# Altium schematic sheet 05-Power.SchDoc
size A
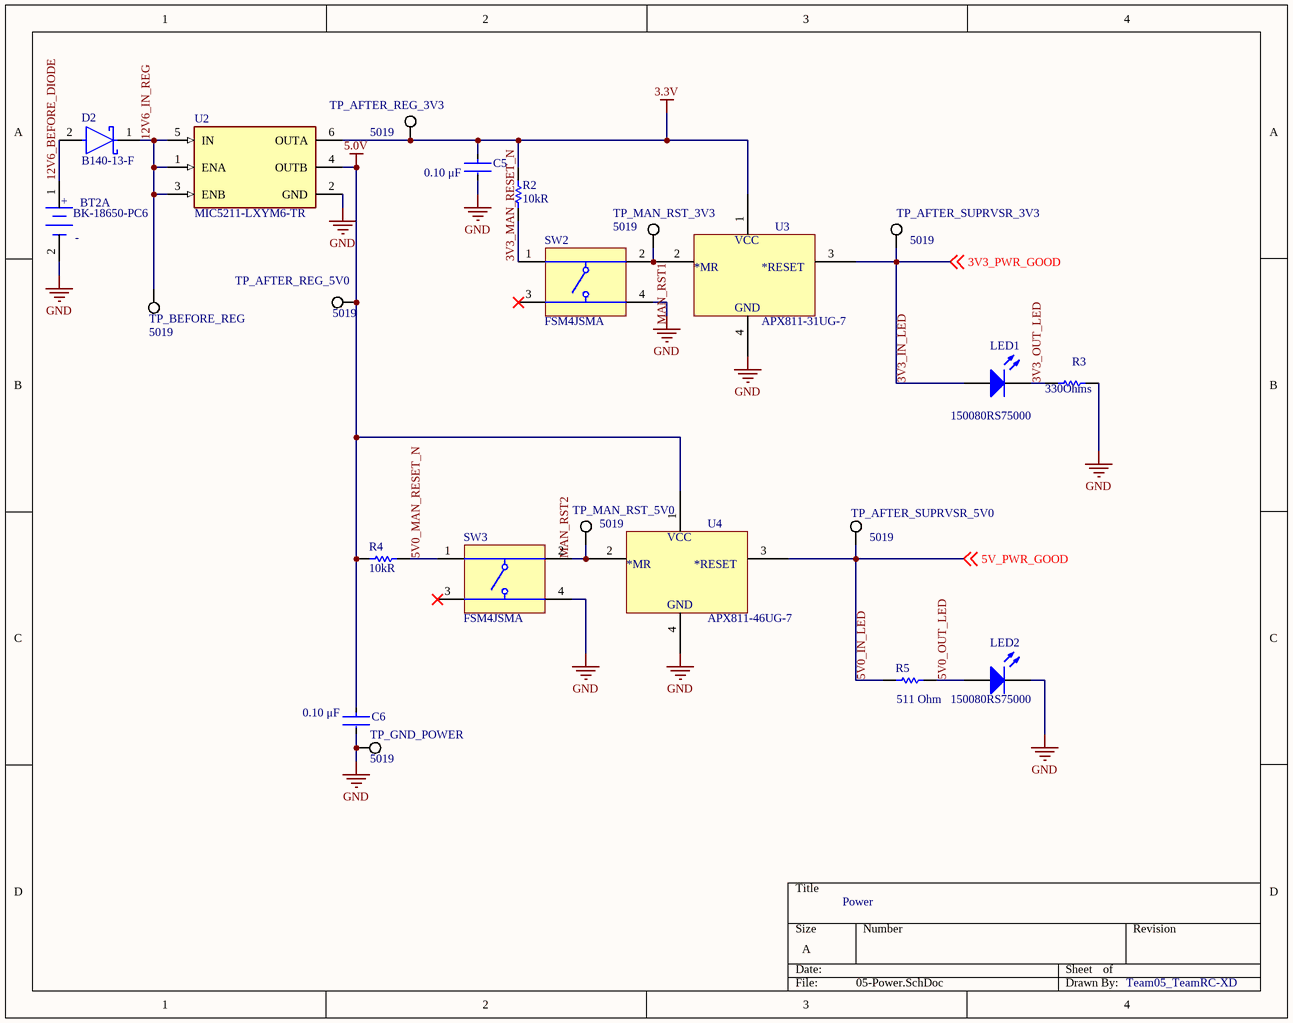
[diagram p0: 05-Power.SchDoc]

## Parts
BT2  BK-18650-PC6  [FP-BK-18650-PC6-MFG]  (part A of 3)
C5  Capacitance: 0.10 μF  [FP-C0805C-DN-MFG]  (hidden comment: C0805C104K1RACAUTO)
C6  Capacitance: 0.10 μF  [FP-C0805C-DN-MFG]  (hidden comment: C0805C104K1RACAUTO)
D2  B140-13-F  [FP-SMA-MFG]
LED1  150080RS75000  [0805_A]
LED2  150080RS75000  [0805_A]
R2  Resistance: 10kR  [RESC2013X60X35NL10T20]  (hidden comment: RC0805FR-0710KL)
R3  Resistance: 330Ohms  [RESC2013X60X35LL10T20]  (hidden comment: RC0805FR-07330RL)
R4  Resistance: 10kR  [RESC2013X60X35NL10T20]  (hidden comment: RC0805FR-0710KL)
R5  Resistance: 511 Ohm  [RESC2013X70X40ML20T20]  (hidden comment: ERJ-6ENF5110V)
SW2  FSM4JSMA  [TECO-FSM4JSMA_V]
SW3  FSM4JSMA  [TECO-FSM4JSMA_V]
TP_AFTER_REG_3V3  5019  [KSTN-5019_V]
TP_AFTER_REG_5V0  5019  [KSTN-5019_V]
TP_AFTER_SUPRVSR_3V3  5019  [KSTN-5019_V]
TP_AFTER_SUPRVSR_5V0  5019  [KSTN-5019_V]
TP_BEFORE_REG  5019  [KSTN-5019_V]
TP_GND_POWER  5019  [KSTN-5019_V]
TP_MAN_RST_3V3  5019  [KSTN-5019_V]
TP_MAN_RST_5V0  5019  [KSTN-5019_V]
U2  MIC5211-LXYM6-TR  [FP-SOT23-6LD-PL-1-MFG]
U3  APX811-31UG-7  [SOT143]
U4  APX811-46UG-7  [SOT143]

## Nets
3.3V: C5.1 R2.2 TP_AFTER_REG_3V3.1 U2.6(OUTA) U3.1
5.0V: C6.1 R4.2 TP_AFTER_REG_5V0.1 U2.4(OUTB) U4.1
GND: BT2.2(1_-) C5.2 C6.2 LED2.1(K) R3.2 SW2.4 SW3.4 TP_GND_POWER.1 U2.2(GND) U3.4 U4.4
3V3_IN_LED: LED1.2(A) TP_AFTER_SUPRVSR_3V3.1 U3.3 ; off-sheet 3V3_PWR_GOOD  [also labelled 3V3_PWR_GOOD]
3V3_MAN_RESET_N: R2.1 SW2.1
3V3_OUT_LED: LED1.1(K) R3.1
5V0_IN_LED: R5.1 TP_AFTER_SUPRVSR_5V0.1 U4.3 ; off-sheet 5V_PWR_GOOD  [also labelled 5V_PWR_GOOD]
5V0_MAN_RESET_N: R4.1 SW3.1
5V0_OUT_LED: LED2.2(A) R5.2
12V6_BEFORE_DIODE: BT2.1(1_+) D2.2(A)
12V6_IN_REG: D2.1(C) TP_BEFORE_REG.1 U2.1(ENA) U2.3(ENB) U2.5(IN)
MAN_RST1: SW2.2 TP_MAN_RST_3V3.1 U3.2
MAN_RST2: SW3.2 TP_MAN_RST_5V0.1 U4.2

Not connected (* = marked no-connect by the designer): SW2 3*; SW3 3*

## Notes on the sheet
- Power
- Team05_TeamRC-XD
- (in symbol APX811-31UG-7) VCC; *MR; *RESET; GND
- (in symbol APX811-46UG-7) VCC; *MR; *RESET; GND
- (in symbol CMP-136234-000001-1, part A) +

## Library data of the parts
BT2 = CMP-136234-000001-1: BATT HOLDER 18650 3 CELL PC PIN; Manufacturer: MPD (Memory Protection Devices); Pitch: 72.9mm; Number Of Contacts: 3; Conn Orientation: Top View; Conn Gender: Female; Octopart: https://octopart.com/bk-18650-pc6-memory+protection+devices-19049091; ComponentLink2URL: http://www.memoryprotectiondevices.com/datasheets/BK-18650-PC6-datasheet.pdf; Category: Batt; RoHS: TRUE; Temperature Range High: +180°C; Height: 22.04mm; Device Class L2: Power Connectors; Digikey Description: BATT HOLDER 18650 3 CELL PC PIN; ComponentLink2Description: Datasheet; Temperature: -40°C to +180°C; Device Class L1: Connectors; Lead Free: Yes; Device Class L3: unset; Contact Material: Nickel; Automotive: No; Temperature Range Low: -40°C; Manufacturer Part Number: BK-18650-PC6; Package: 0; Supplier 1: Digi-Key; Supplier Part Number 1: BK-18650-PC6-ND; Stock 1: 1587; Pricing 1: 1=7.26000, 10=6.10600, 50=5.36040, 100=5.04800, 250=4.63932, 500=4.35088, 1000=4.06242, 2500=3.67782 (USD); Mount: Through Hole,PCB; Package Quantity: 100; Number of Cells: 3; Termination: PC Pin; Series: -; ComponentLink1URL: https://datasheet.ciiva.com/3/bk-18650-pc6-datasheet-3897.pdf?src-supplier=Digi-Key; ComponentLink1Description: https://datasheet.ciiva.com/3/bk-18650-pc6-datasheet-3897.pdf?src-supplier=Digi-Key
C5 C6 = CMP-2007-03648-2: CAP CER 0.1UF 100V X7R 0805; Manufacturer: KEMET; Temperature Coefficient: 30ppm/°C; Material: Ceramic; Tolerance: 0.1; Value: 0.10 μF; Category: Cap; Temperature: -55°C to +125°C; ComponentLink2Description: Datasheet; Temperature Range Low: -55°C; Device Class L2: Capacitors; ComponentLink2URL: https://content.kemet.com/datasheets/KEM_C1003_C0G_SMD.pdf; Ipc Land Pattern Name: CAPC200125X78; Temperature Range High: +125°C; Package: C0805C-DN; Temperature Characteristic: X7R; Height: 0.88mm; Digikey Description: CAP CER 0.1UF 100V X7R 0805; Voltage Rating: 100 V; Device Class L3: Ceramic Capacitors; Manufacturer Part Number: C0805C104K1RACAUTO; Device Class L1: Passive Components; Lead Free: Yes; RoHS: TRUE; Automotive: No; Octopart: https://octopart.com/c0805c104k1racauto-kemet-12625098; Supplier 1: Digi-Key; Supplier Part Number 1: 399-6926-1-ND; Stock 1: 110100; Pricing 1: 1=0.28000, 10=0.19000, 50=0.12640, 100=0.10750, 500=0.07588, 1000=0.06639 (USD); Mount: Surface Mount; Case/Package: 0805; Case Code (Metric): 2012; Case Code (Imperial): 0805; Dielectric Material: Ceramic; Contact Plating: Tin,Matte; Min Operating Temperature: -55°C; Max Operating Temperature: 125°C; Packaging: Tape and Reel; Package Quantity: 1; Dielectric: X7R; Voltage Rating (DC): 100V; Series: C; Construction: Flat; Length: 2mm; Width: 0.049inch; Depth: 1.25mm; Thickness: 0.043inch; Ratings: AEC-Q200; Radiation Hardening: No; RoHS Compliant: Yes; REACH SVHC: No SVHC; ComponentLink1URL: https://datasheet.ciiva.com/7842/1732729-7842181.pdf?src-supplier=Element14; ComponentLink1Description: https://datasheet.ciiva.com/7842/1732729-7842181.pdf?src-supplier=Element14
D2 = CMP-2000-05096-2: DIODE SCHOTTKY 40V 1A SMA; Manufacturer: Diodes; Element Configuration: Single; Capacitance: 110pF; Forward Voltage: 500mV; Max Forward Surge Current (Ifsm): 30A; Max Reverse Current: 500uA; Polarity: Standard; Package Quantity: 5000; Average Rectified Current: 1A; Height: 2.1mm; Max Operating Temperature: 150°C; Radiation Hardening: No; Mount: Surface Mount; REACH SVHC: No SVHC; Contact Plating: Tin; Width: 2.92mm; RoHS Compliant: Yes; Max Repetitive Reverse Voltage (Vrrm): 40V; Current Rating: 1A; Termination: SMD/SMT; Number of Pins: 2; Max Reverse Voltage (DC): 40V; Series: B140; Length: 4.6mm; Forward Current: 1A; Voltage Rating (DC): 40V; Lead Free: Lead Free; Weight: 0.004233oz; Output Current: 1A; Case/Package: SMA; Min Operating Temperature: -65°C; Packaging: Cut Tape; Peak Non-Repetitive Surge Current: 30A; Supplier 1: Digi-Key; Supplier Part Number 1: B140-FDICT-ND; Manufacturer Part Number: B140-13-F; RoHS: Yes; Category: Rectifier Diodes; Stock 1: 127730; Pricing 1: 1=0.41000, 10=0.33800, 100=0.17930, 500=0.11796, 1000=0.08022, 2000=0.07236 (USD); ComponentLink1URL: https://datasheet.ciiva.com/15220/getdatasheetpartid-115924-15220197.pdf?src-supplier=Verical; ComponentLink1Description: https://datasheet.ciiva.com/15220/getdatasheetpartid-115924-15220197.pdf?src-supplier=Verical; ComponentLink2URL: https://datasheet.ciiva.com/912/ds13002-912361.pdf?src-supplier=Digi-Key; ComponentLink2Description: https://datasheet.ciiva.com/912/ds13002-912361.pdf?src-supplier=Digi-Key; ComponentLink3URL: https://datasheet.ciiva.com/912/ds13002-912362.pdf?src-supplier=Digi-Key; ComponentLink3Description: https://datasheet.ciiva.com/912/ds13002-912362.pdf?src-supplier=Digi-Key; ComponentLink4URL: https://datasheet.ciiva.com/912/ds13002-912360.pdf?src-supplier=Digi-Key; ComponentLink4Description: https://datasheet.ciiva.com/912/ds13002-912360.pdf?src-supplier=Digi-Key
LED1 LED2 = CMP-1426-00011-1: SMD mono-color Chip LED, WL-SMCW, Red; Manufacturer: Wuerth Elektronik; Luminous Intensity: 150mcd; Viewing Angle: 140°; Forward Voltage: 2V; Wavelength: 625nm; Lens Style: Clear,Rectangular; Forward Current: 30mA; Test Current: 20mA; Color: Red; PartNumber: 150080RS75000; PackageReference: 0805_A; ComponentLink2Description: Datasheet; ComponentLink1URL: http://www.we-online.com; ComponentLink1Description: Manufacturer URL; ComponentLink2URL: http://katalog.we-online.com/led/datasheet/150080RS75000.pdf; Supplier 1: Digi-Key; Supplier Part Number 1: 732-4984-1-ND; Manufacturer Part Number: 150080RS75000; RoHS: Yes; Category: LEDs; Stock 1: 96501; Pricing 1: 1=0.19000, 50=0.17600, 100=0.15100, 500=0.13100 (USD); Mount: Surface Mount; Case/Package: 0805; Case Code (Metric): 2012; Case Code (Imperial): 0805; Min Operating Temperature: -40°C; Max Operating Temperature: 85°C; Package Quantity: 4000; Packaging: Tape and Reel; Dominant Wavelength: 625nm; Length: 2mm; Width: 1.25mm; Height: 0.7mm; REACH SVHC: Unknown; RoHS Compliant: Yes; ComponentLink3URL: https://datasheet.ciiva.com/22656/150080rs75000-22656961.pdf?src-supplier=Element14; ComponentLink3Description: https://datasheet.ciiva.com/22656/150080rs75000-22656961.pdf?src-supplier=Element14; ComponentLink4URL: https://datasheet.ciiva.com/29279/759435-da-01-en-chipled-0805-w-kl-rot-150080rs75000-29279032.pdf?src-supplier=Conrad; ComponentLink4Description: https://datasheet.ciiva.com/29279/759435-da-01-en-chipled-0805-w-kl-rot-150080rs75000-29279032.pdf?src-supplier=Conrad
R2 R4 = CMP-1659-00013-4: Chip Resistor, 10 KOhm, +/- 1%, 0.125 W, -55 to 155 degC, 0805 (2012 Metric), RoHS, Tape and Reel; Manufacturer: Yageo; Voltage Rating: 150 V; Power Rating: 125mW; Temperature Coefficient: 100ppm/°C; Mount: Surface Mount; ComponentLink1Description: Manufacturer URL; ComponentLink2URL: http://www.yageo.com/documents/recent/PYu-RC_Group_51_RoHS_L_04.pdf; Pins: 2; Length: 2 mm; Min Operating Temperature: -55 degC; Height: 0.5 mm; Mounting Technology: Surface Mount; RoHSCompliant: true; REACH SVHC: No SVHC; ComponentLink1URL: http://www.yageo.com/; Max Operating Temperature: 155 degC; PackageReference: 0805; DatasheetVersion: Rev. 4, 02/2016; Package Quantity: 5000; Packaging: Tape and Reel; ComponentLink2Description: Datasheet; PackageDescription: 2-Pin Surface Mounted Device, Body 2 x 1.25 mm; Supplier 1: Digi-Key; Supplier Part Number 1: 311-10.0KCRCT-ND; Manufacturer Part Number: RC0805FR-0710KL; RoHS: Yes; Category: Chip SMD Resistors; Stock 1: 12576286; Pricing 1: 1=0.10000, 10=0.03700, 100=0.01520, 1000=0.00682, 2500=0.00592 (USD); Case/Package: 0805; Case Code (Imperial): 0805; Case Code (Metric): 2012; Size Code: 0805; Tolerance: 1%; Termination: SMD/SMT; Resistor Type: Thick Film; Number of Terminations: 2; Max Power Dissipation: 125mW; Features: Moisture Resistant; Series: RC; Construction: Rectangular; Resistance Tolerance: 1%; Technology: THICK FILM; Width: 0.049inch; Depth: 1.25mm; Military Standard: Not; Lead Free: Lead Free; RoHS Compliant: Yes; ComponentLink3URL: https://datasheet.ciiva.com/11808/0900766b8106beab-11808151.pdf?src-supplier=RSComponents; ComponentLink3Description: https://datasheet.ciiva.com/11808/0900766b8106beab-11808151.pdf?src-supplier=RSComponents; ComponentLink4URL: https://datasheet.ciiva.com/46447/444164-46447563.pdf?src-supplier=Element14; ComponentLink4Description: https://datasheet.ciiva.com/46447/444164-46447563.pdf?src-supplier=Element14; ComponentLink5URL: https://datasheet.ciiva.com/2456/pyu-r-int-thick-7-2456973.pdf?src-supplier=Digi-Key; ComponentLink5Description: https://datasheet.ciiva.com/2456/pyu-r-int-thick-7-2456973.pdf?src-supplier=Digi-Key; ComponentLink6URL: https://datasheet.ciiva.com/2456/pyu-r-int-thick-7-2456974.pdf?src-supplier=Digi-Key; ComponentLink6Description: https://datasheet.ciiva.com/2456/pyu-r-int-thick-7-2456974.pdf?src-supplier=Digi-Key; ComponentLink7URL: https://datasheet.ciiva.com/2456/pyu-r-int-thick-7-2456972.pdf?src-supplier=Digi-Key; ComponentLink7Description: https://datasheet.ciiva.com/2456/pyu-r-int-thick-7-2456972.pdf?src-supplier=Digi-Key; ComponentLink8URL: https://datasheet.ciiva.com/12669/rc0805-12669688.pdf?src-supplier=Mouser; ComponentLink8Description: https://datasheet.ciiva.com/12669/rc0805-12669688.pdf?src-supplier=Mouser; ComponentLink9URL: https://datasheet.ciiva.com/16747/rc0805-16747087.pdf?src-supplier=Future+Electronics; ComponentLink9Description: https://datasheet.ciiva.com/16747/rc0805-16747087.pdf?src-supplier=Future+Electronics
R3 = CMP-2000-06960-1: Chip Resistor, 330 Ohm, +/- 1%, 125 mW, -55 to 155 degC, 0805 (2012 Metric), RoHS, Tape and Reel; Manufacturer: Yageo; Voltage Rating: 150V; Temperature Coefficient: 100PPM/C; Power Rating: 125mW(1/8W); Max Power Dissipation: 125mW; Datasheet Version: Rev. 7, 05/2017; Termination Style: SMD/SMT; Case Code - mm: 2012; Package Description: 2-Pin Surface Mounted Device, Body 2 x 1.25 mm; Operating Temperature Range: -55Cto+155C; Case Code - in: 0805; Packaging: Reel; Tolerance: 1%; Package Reference: 0805; Mounting Technology: SurfaceMount; Product: ThickFilmResistorsGeneralPurpose; Series: RC; Manufacturer URL: http://www.yageo.com/; Datasheet URL: http://www.yageo.com/documents/recent/PYu-RC_Group_51_RoHS_L_7.pdf; Supplier 1: Digi-Key; Supplier Part Number 1: 311-330CRCT-ND; Manufacturer Part Number: RC0805FR-07330RL; RoHS: Yes; Category: Chip SMD Resistors; Stock 1: 1384868; Pricing 1: 1=0.10000, 10=0.03700, 100=0.01510, 1000=0.00680, 2500=0.00590 (USD); Case/Package: 0805; Case Code (Imperial): 0805; Case Code (Metric): 2012; Size Code: 0805; Min Operating Temperature: -55°C; Max Operating Temperature: 155°C; Resistor Type: Thick Film; Package Quantity: 5000; Termination: SMD/SMT; Number of Terminations: 2; Features: Moisture Resistant; Resistance Tolerance: 1%; Construction: Rectangular; Length: 2mm; Width: 0.049inch; Height: 0.024inch; Depth: 1.25mm; REACH SVHC: Unknown; Lead Free: Lead Free; Military Standard: Not; RoHS Compliant: Yes; ComponentLink1URL: https://datasheet.ciiva.com/2457/pyu-r-int-thick-7-2457015.pdf?src-supplier=Digi-Key; ComponentLink1Description: https://datasheet.ciiva.com/2457/pyu-r-int-thick-7-2457015.pdf?src-supplier=Digi-Key; ComponentLink2URL: https://datasheet.ciiva.com/2457/pyu-r-int-thick-7-2457016.pdf?src-supplier=Digi-Key; ComponentLink2Description: https://datasheet.ciiva.com/2457/pyu-r-int-thick-7-2457016.pdf?src-supplier=Digi-Key; ComponentLink3URL: https://datasheet.ciiva.com/2457/pyu-r-int-thick-7-2457014.pdf?src-supplier=Digi-Key; ComponentLink3Description: https://datasheet.ciiva.com/2457/pyu-r-int-thick-7-2457014.pdf?src-supplier=Digi-Key; ComponentLink4URL: https://datasheet.ciiva.com/12667/rc0805-12667925.pdf?src-supplier=Mouser; ComponentLink4Description: https://datasheet.ciiva.com/12667/rc0805-12667925.pdf?src-supplier=Mouser; ComponentLink5URL: https://datasheet.ciiva.com/7941/444164-7941768.pdf?src-supplier=Element14; ComponentLink5Description: https://datasheet.ciiva.com/7941/444164-7941768.pdf?src-supplier=Element14; ComponentLink6URL: https://datasheet.ciiva.com/7941/444164-7941769.pdf?src-supplier=Element14; ComponentLink6Description: https://datasheet.ciiva.com/7941/444164-7941769.pdf?src-supplier=Element14; ComponentLink7URL: https://datasheet.ciiva.com/16740/rc0805-16740975.pdf?src-supplier=Future+Electronics; ComponentLink7Description: https://datasheet.ciiva.com/16740/rc0805-16740975.pdf?src-supplier=Future+Electronics
R5 = CMP-2001-00217-1: 511 Ohm Resisitor; Manufacturer: Panasonic; Tolerance: 1%; Power Rating: 125mW; Voltage Rating: 150V; Temperature Coefficient: 100ppm/°C; Part Number: ERJ-6ENF5110V; Supplier 1: Digi-Key; Supplier Part Number 1: P511CCT-ND; Manufacturer Part Number: ERJ-6ENF5110V; RoHS: Yes; Category: Chip SMD Resistors; Stock 1: 53410; Pricing 1: 1=0.10000, 10=0.08800, 100=0.03390, 1000=0.01492, 2500=0.01288 (USD); Mount: Surface Mount; Case/Package: 0805; Case Code (Imperial): 0805; Case Code (Metric): 2012; Contact Plating: Tin; Min Operating Temperature: -55°C; Max Operating Temperature: 155°C; Packaging: Tape and Reel; Package Quantity: 5000; Resistor Type: Thick Film; Number of Terminations: 2; Max Power Dissipation: 125mW; Features: Automotive AEC-Q200; Series: ERJ; Resistance Tolerance: 1%; Termination: SMD/SMT; Construction: Rectangular; Voltage Rating (DC): 150V; Technology: THICK FILM; Length: 2mm; Width: 1.2mm; Height: 0.6mm; Depth: 1.25mm; Radiation Hardening: No; Reach SVHC Compliant: Unknown; Military Standard: Not; Lead Free: Lead Free; RoHS Compliant: Yes; ComponentLink1URL: https://datasheet.ciiva.com/34303/1989421-34303638.pdf?src-supplier=Jameco; ComponentLink1Description: https://datasheet.ciiva.com/34303/1989421-34303638.pdf?src-supplier=Jameco; ComponentLink2URL: https://datasheet.ciiva.com/5870/426256-5870822.pdf?src-supplier=Farnell; ComponentLink2Description: https://datasheet.ciiva.com/5870/426256-5870822.pdf?src-supplier=Farnell; ComponentLink3URL: https://datasheet.ciiva.com/9117/aoa0000ce2-9117326.pdf?src-supplier=Avnet; ComponentLink3Description: https://datasheet.ciiva.com/9117/aoa0000ce2-9117326.pdf?src-supplier=Avnet; ComponentLink4URL: https://datasheet.ciiva.com/24069/aoa0000ce2-24069817.pdf?src-supplier=Mouser; ComponentLink4Description: https://datasheet.ciiva.com/24069/aoa0000ce2-24069817.pdf?src-supplier=Mouser; ComponentLink5URL: https://datasheet.ciiva.com/30247/aoa0000ce2-30247912.pdf?src-supplier=Onlinecomponents.com; ComponentLink5Description: https://datasheet.ciiva.com/30247/aoa0000ce2-30247912.pdf?src-supplier=Onlinecomponents.com; ComponentLink6URL: https://datasheet.ciiva.com/28536/1678782-28536315.pdf?src-supplier=Element14; ComponentLink6Description: https://datasheet.ciiva.com/28536/1678782-28536315.pdf?src-supplier=Element14; ComponentLink7URL: https://datasheet.ciiva.com/16760/70260748-16760587.pdf?src-supplier=Allied+Electronics; ComponentLink7Description: https://datasheet.ciiva.com/16760/70260748-16760587.pdf?src-supplier=Allied+Electronics; ComponentLink8URL: https://datasheet.ciiva.com/46389/426256-46389359.pdf?src-supplier=Element14; ComponentLink8Description: https://datasheet.ciiva.com/46389/426256-46389359.pdf?src-supplier=Element14; ComponentLink9URL: https://datasheet.ciiva.com/46377/426256-46377833.pdf?src-supplier=Element14; ComponentLink9Description: https://datasheet.ciiva.com/46377/426256-46377833.pdf?src-supplier=Element14
SW2 SW3 = CMP-2000-05602-2: Swicth, SPST, 24 V, -35 to 85 degC, 4-Pin SMD, RoHS, Tape and Reel; Manufacturer: TE Connectivity; Switch Travel: 0.25mm; Mechanical Life: 100000Cycles; Contact Current Rating: 50mA; Operating Force: 1.57N; Actuator Material: Polyamide; Contact Resistance: 100mOhm; Voltage Rating: 24V; Illumination Type: Illuminated; Actuator Length: 0.055inch; Max Voltage Rating (DC): 12V; Case\/Package: SMD/SMT; Switch Function: Off-Mom; Actuator Type: Standard; Insulation Resistance: 100MR; Orientation: Straight; Datasheet URL: http://www.te.com/commerce/DocumentDelivery/DDEController?Action=showdoc&DocId=Customer+Drawing%7F2-1437565-7%7FV%7Fpdf%7FEnglish%7FENG_CD_2-1437565-7_V.pdf%7F4-1437565-2; Min Operating Temperature: -35degC; Packaging: LoosePiece; Termination: GullWing; Throw Configuration: SPST; Package Description: 4-Pin Surface Mount Device, Body 6 x 6 mm, Pitch 4.5 mm; Mounting Technology: SurfaceMount; Contact Plating: Silver; Datasheet Version: Rev. V, 02/2015; RoHSCompliant: true; Max Operating Temperature: 85degC; Length: 6mm; Voltage Rating (DC): 24V; Electrical Life: 100000Cycles; Current Rating: 50mA; Package Quantity: 750; Mount: SurfaceMount; Package Reference: FSM4JSMA; Manufacturer URL: http://www.te.com/; Width: 6mm; REACH SVHC: Unknown; Contact Material: CopperAlloy; Supplier 1: Digi-Key; Supplier Part Number 1: 450-1129-ND; Manufacturer Part Number: FSM4JSMA; RoHS: Yes; Category: Pushbutton Switches; Stock 1: 64604; Pricing 1: 1=0.270000, 10=0.263000, 25=0.249600, 100=0.226000, 250=0.206040, 750=0.191520, 1500=0.163390, 3000=0.158850, 5250=0.149770 (USD); Case/Package: SMD/SMT; Color: Black; Series: FSMJSMA; Max Current Rating: 50mA; Depth: 10mm; Radiation Hardening: No; RoHS Compliant: Yes; Lead Free: Lead Free; ELV: Compliant; ComponentLink1URL: https://datasheet.ciiva.com/14635/0900766b80912216-14635826.pdf?src-supplier=Allied+Electronics; ComponentLink1Description: https://datasheet.ciiva.com/14635/0900766b80912216-14635826.pdf?src-supplier=Allied+Electronics
TP_AFTER_REG_3V3 TP_AFTER_REG_5V0 TP_AFTER_SUPRVSR_3V3 TP_AFTER_SUPRVSR_5V0 TP_BEFORE_REG TP_GND_POWER TP_MAN_RST_3V3 TP_MAN_RST_5V0 = CMP-1672-00008-1: Test Point, 1 Position SMD, RoHS, Tape and Reel; Manufacturer: Keystone Electronics; ComponentLink1Description: Manufacturer URL; Package Quantity: 1000; DatasheetVersion: 03/2014; Packaging: Tape and Reel; ComponentLink2URL: http://www.keyelco.com/product-pdf.cfm?p=1357; ComponentLink1URL: http://www.keyelco.com/; Mount: Surface Mount; Contact Plating: Silver; PackageDescription: 1-Pin Surface Mount Device, Body 3.81 x 2.03 mm; Pins: 1; RoHSCompliant: True; Mounting Technology: Surface Mount; ComponentLink2Description: Datasheet; PackageReference: 5019; Supplier 1: Digi-Key; Supplier Part Number 1: 36-5019CT-ND; Manufacturer Part Number: 5019; RoHS: Yes; Category: Connectors; Stock 1: 1293364; Pricing 1: 1=0.34000, 25=0.27360, 100=0.22340, 250=0.20064, 500=0.19152 (USD); Number of Pins: 1; Material: Bronze; Contact Material: Bronze; Termination: SMD/SMT; Series: 5019; Height: 0.09inch; REACH SVHC: No SVHC; RoHS Compliant: Yes; Lead Free: Lead Free; ComponentLink3URL: https://datasheet.ciiva.com/16318/m60-2p61-16318395.pdf?src-supplier=Future+Electronics; ComponentLink3Description: https://datasheet.ciiva.com/16318/m60-2p61-16318395.pdf?src-supplier=Future+Electronics; ComponentLink4URL: https://datasheet.ciiva.com/16885/70182998-16885945.pdf?src-supplier=Allied+Electronics; ComponentLink4Description: https://datasheet.ciiva.com/16885/70182998-16885945.pdf?src-supplier=Allied+Electronics; ComponentLink5URL: https://datasheet.ciiva.com/14848/m60-2p61-14848437.pdf?src-supplier=Digi-Key; ComponentLink5Description: https://datasheet.ciiva.com/14848/m60-2p61-14848437.pdf?src-supplier=Digi-Key; ComponentLink6URL: https://datasheet.ciiva.com/14848/m60-2p61-14848438.pdf?src-supplier=Digi-Key; ComponentLink6Description: https://datasheet.ciiva.com/14848/m60-2p61-14848438.pdf?src-supplier=Digi-Key; ComponentLink7URL: https://datasheet.ciiva.com/14848/m60-2p61-14848439.pdf?src-supplier=Digi-Key; ComponentLink7Description: https://datasheet.ciiva.com/14848/m60-2p61-14848439.pdf?src-supplier=Digi-Key
U2 = CMP-06324-000039-1: IC REG LINEAR 3.3V/5V SOT23-6; Manufacturer: Microchip; Min Input Voltage: 2.5V; Number of Regulators: 2; Dropout Voltage: 250mV; Current - Output 1: 80mA; Voltage - Output 2: 5V; Voltage - Output 1: 3.3V; Max Input Voltage: 16V; Case/Package: SOT-23-6; REACH SVHC: No SVHC; Output Voltage: 5V; Current - Output 2: 80mA; Number of Outputs: 2; Mount: Surface Mount; Number of Pins: 6; Output Current: 80mA; Packaging: Cut Tape; Min Operating Temperature: -40°C; Max Operating Temperature: 125°C; Lead Free: Lead Free; Supplier 1: Digi-Key; Supplier Part Number 1: 576-2749-1-ND; Manufacturer Part Number: MIC5211-LXYM6-TR; RoHS: Yes; Category: Voltage Regulators - Linear; Stock 1: 9077; Pricing 1: 1=1.00000, 25=0.81640, 100=0.76500 (USD); ComponentLink1URL: http://www.farnell.com/datasheets/1833750.pdf?src-supplier=Farnell; ComponentLink1Description: http://www.farnell.com/datasheets/1833750.pdf?src-supplier=Farnell; ComponentLink2URL: http://www.mouser.com/ds/2/495/mic5211-480031.pdf?src-supplier=Mouser; ComponentLink2Description: http://www.mouser.com/ds/2/495/mic5211-480031.pdf?src-supplier=Mouser; ComponentLink3URL: http://components.arrow.com/part/dataview/42838406S9415880N1374?src-supplier=Arrow+Electronics; ComponentLink3Description: http://components.arrow.com/part/dataview/42838406S9415880N1374?src-supplier=Arrow+Electronics; ComponentLink4URL: http://www.farnell.com/datasheets/1833750.pdf?src-supplier=Element14; ComponentLink4Description: http://www.farnell.com/datasheets/1833750.pdf?src-supplier=Element14; ComponentLink5URL: http://www.microchip.com/mymicrochip/filehandler.aspx?ddocname=en600301&src-supplier=Digi-Key; ComponentLink5Description: http://www.microchip.com/mymicrochip/filehandler.aspx?ddocname=en600301&src-supplier=Digi-Key; ComponentLink6URL: http://www.micrel.com/_PDF/mic5211.pdf?src-supplier=Future+Electronics; ComponentLink6Description: http://www.micrel.com/_PDF/mic5211.pdf?src-supplier=Future+Electronics
U3 = APX811-31UG-7: IC SUPERVISOR 3.08V SOT143-4; Manufacturer: Diodes; Max Supply Voltage: 5.5V; Min Supply Voltage: 1.1V; Max Power Dissipation: 320mW; Watchdog Timer: No; Max Reset Threshold Voltage: 3.13V; Min Reset Threshold Voltage: 3.03V; Number of Voltages Monitored: 1; Reset: Active Low; Reset Timeout: 140ms; Output: TOTEM-POLE; Undervoltage Threshold: 4.7V; Operating Supply Current: 30uA; Reset Delay Time: 200ms; Supplier 1: Digi-Key; Supplier Part Number 1: APX811-31UG-7DICT-ND; Manufacturer Part Number: APX811-31UG-7; RoHS: Yes; Category: Voltage Supervisors; Stock 1: 201015; Pricing 1: 1=0.44000, 10=0.37600, 25=0.35040, 100=0.28050, 250=0.26044, 500=0.22038, 1000=0.17029 (USD); Mount: Surface Mount; Case/Package: SOT-143; Number of Pins: 4; Min Operating Temperature: -40°C; Max Operating Temperature: 85°C; Package Quantity: 3000; Packaging: Tape and Reel; Type: Simple Reset/Power-On Reset; Threshold Voltage: 3.08V; Number of Elements: 1; Power Dissipation: 320mW; Series: -; Number of Monitored Inputs: 1; Length: 3mm; Width: 1.4mm; Height: 1mm; Radiation Hardening: No; Reach SVHC Compliant: Yes; Lead Free: Lead Free; ComponentLink1URL: https://datasheet.ciiva.com/15106/getdatasheetpartid-661729-15106637.pdf?src-supplier=Verical; ComponentLink1Description: https://datasheet.ciiva.com/15106/getdatasheetpartid-661729-15106637.pdf?src-supplier=Verical
U4 = APX811-46UG-7: 4-Pin Microprocessor Supervisor With Manual Reset, 5.5V, 20µA, -40°C to 85°C; Manufacturer: Diodes; Min Supply Voltage: 1.1V; Max Power Dissipation: 320mW; Number of Voltages Monitored: 1; Reset: Active Low; Reset Timeout: 140ms; Threshold Voltage: 4.63V; Watchdog Timer: No; Min Reset Threshold Voltage: 4.56V; Max Reset Threshold Voltage: 4.7V; Output: TOTEM-POLE; Operating Supply Current: 30uA; Reset Delay Time: 240ms; Supplier 1: Digi-Key; Supplier Part Number 1: APX811-46UG-7DICT-ND; Manufacturer Part Number: APX811-46UG-7; RoHS: Yes; Category: Voltage Supervisors; Stock 1: 3166; Pricing 1: 1=0.44000, 10=0.37600, 25=0.35040, 100=0.28050, 250=0.26044, 500=0.22038, 1000=0.17029 (USD); Mount: Surface Mount; Case/Package: SOT-143; Number of Pins: 4; Min Operating Temperature: -40°C; Max Operating Temperature: 85°C; Package Quantity: 3000; Packaging: Tape and Reel; Max Supply Voltage: 5.5V; Number of Elements: 1; Power Dissipation: 320mW; Type: Simple Reset/Power-On Reset; Series: -; Overvoltage Threshold: 4.7V; Undervoltage Threshold: 4.56V; Number of Monitored Inputs: 1; Radiation Hardening: No; Reach SVHC Compliant: Yes; Lead Free: Lead Free; ComponentLink1URL: https://datasheet.ciiva.com/1968/apx811-812-1968432.pdf?src-supplier=Digi-Key; ComponentLink1Description: https://datasheet.ciiva.com/1968/apx811-812-1968432.pdf?src-supplier=Digi-Key; ComponentLink2URL: https://datasheet.ciiva.com/13030/apx811-812-9047-13030465.pdf?src-supplier=Mouser; ComponentLink2Description: https://datasheet.ciiva.com/13030/apx811-812-9047-13030465.pdf?src-supplier=Mouser; ComponentLink3URL: https://datasheet.ciiva.com/1968/apx811-812-1968430.pdf?src-supplier=Digi-Key; ComponentLink3Description: https://datasheet.ciiva.com/1968/apx811-812-1968430.pdf?src-supplier=Digi-Key; ComponentLink4URL: https://datasheet.ciiva.com/1968/apx811-812-1968431.pdf?src-supplier=Digi-Key; ComponentLink4Description: https://datasheet.ciiva.com/1968/apx811-812-1968431.pdf?src-supplier=Digi-Key